# Altium schematic sheet Core.SchDoc
size A3
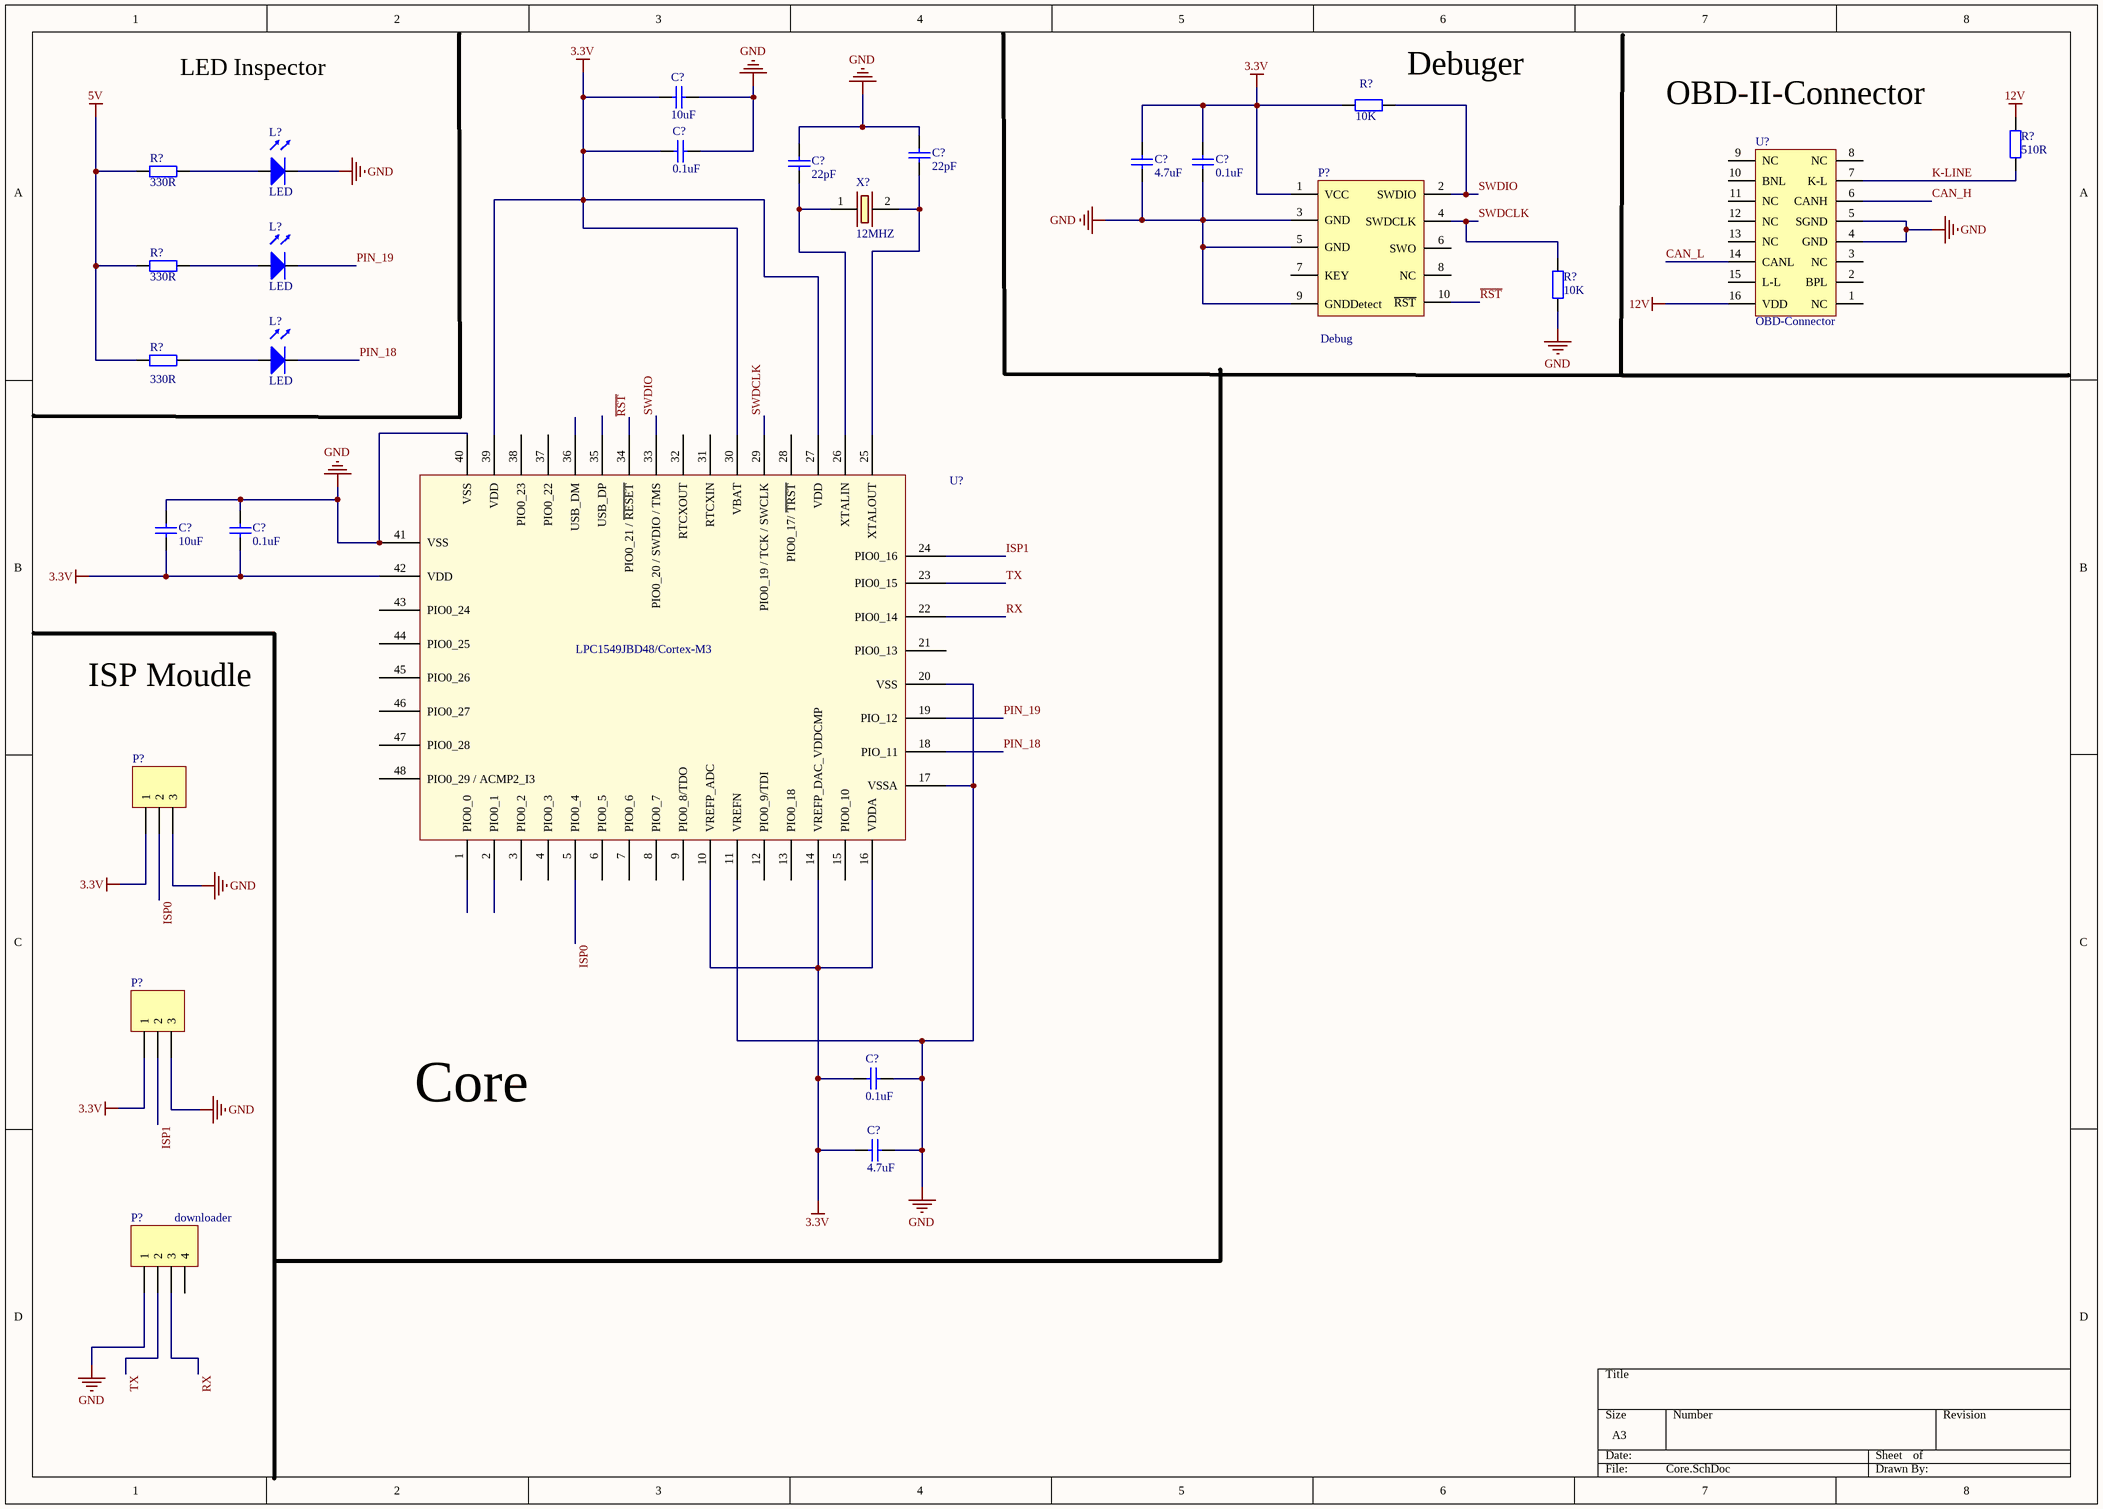
[diagram p0: Core.SchDoc]

## Parts
(Parts that share a designator on the sheet are numbered #1, #2 ... from top to bottom, then left to right.)
C?#1  10uF  [0603]
C?#2  0.1uF  [0603]
C?#3  22pF  [0603]
C?#4  22pF  [0603]
C?#5  4.7uF  [0603]
C?#6  0.1uF  [0603]
C?#7  10uF  [0603]
C?#8  0.1uF  [0603]
C?#9  0.1uF  [0603]
C?#10  4.7uF  [0603]
L?#1  LED  [0805]
L?#2  LED  [0805]
L?#3  LED  [0805]
P?#1  Debug  [JATG_10pin]
P?#2  (no value)  [HDR1X3]
P?#3  (no value)  [HDR1X3]
P?#4  downloader  [HDR1X4]
R?#1  10K  [0603]
R?#2  510R  [0603]
R?#3  330R  [0603]
R?#4  330R  [0603]
R?#5  10K  [0603]
R?#6  330R  [0603]
U?#1  OBD-Connector  [OBD-MaleConnector]
U?#2  LPC1549  [LPC1549JBD48]  (value not drawn)
X?  12MHZ  [12Mhz-DFN]

## Nets
3.3V: C?#1.2 C?#2.2 C?#5.2 C?#6.2 C?#7.1 C?#8.1 C?#9.2 C?#10.2 P?#1.1(VCC) P?#2.1 P?#3.1 R?#1.1 U?#2.10(VREFP_ADC) U?#2.14(VREFP_DAC_VDDCMP) U?#2.16(VDDA) U?#2.27(VDD) U?#2.30(VBAT) U?#2.39(VDD) U?#2.42(VDD)
5V: R?#3.1 R?#4.1 R?#6.1
12V: R?#2.2 U?#1.16(VDD)
GND: C?#1.1 C?#2.1 C?#3.2 C?#4.2 C?#5.1 C?#6.1 C?#7.2 C?#8.2 C?#9.1 C?#10.1 L?#1.2(K) P?#1.3(GND) P?#1.5(GND) P?#1.9(GNDDetect) P?#2.3 P?#3.3 P?#4.1 R?#5.1 U?#1.4(GND) U?#1.5(SGND) U?#2.11(VREFN) U?#2.17(VSSA) U?#2.20(VSS) U?#2.40(VSS) U?#2.41(VSS)
CAN_H: U?#1.6(CANH)
CAN_L: U?#1.14(CANL)
ISP0: P?#2.2 U?#2.5(PIO0_4)
ISP1: P?#3.2 U?#2.24(PIO0_16)
K-LINE: R?#2.1 U?#1.7(K-L)
PIN_18: L?#3.2(K) U?#2.18(PIO_11)
PIN_19: L?#2.2(K) U?#2.19(PIO_12)
~{RST}: P?#1.10(~{RST}) U?#2.34(PIO0_21_/_~{RESET})
RX: P?#4.3 U?#2.22(PIO0_14)
SWDCLK: P?#1.4(SWDCLK) R?#5.2 U?#2.29(PIO0_19_/_TCK_/_SWCLK)
SWDIO: P?#1.2(SWDIO) R?#1.2 U?#2.33(PIO0_20_/_SWDIO_/_TMS)
TX: P?#4.2 U?#2.23(PIO0_15)
NetC?#3_1: C?#3.1 U?#2.25(XTALOUT) X?.2
NetC?#4_1: C?#4.1 U?#2.26(XTALIN) X?.1
NetL?#1_1: L?#1.1(A) R?#3.2
NetL?#2_1: L?#2.1(A) R?#4.2
NetL?#3_1: L?#3.1(A) R?#6.2

Not connected (* = marked no-connect by the designer): P?#1 6(SWO) 7(KEY) 8(NC); P?#4 4; U?#1 1(NC) 2(BPL) 3(NC) 8(NC) 9(NC) 10(BNL) 11(NC) 12(NC) 13(NC) 15(L-L); U?#2 1(PIO0_0) 2(PIO0_1) 3(PIO0_2) 4(PIO0_3) 6(PIO0_5) 7(PIO0_6) 8(PIO0_7) 9(PIO0_8/TDO) 12(PIO0_9/TDI) 13(PIO0_18) 15(PIO0_10) 21(PIO0_13) 28(PIO0_17/_~{TRST}) 31(RTCXIN) 32(RTCXOUT) 35(USB_DP) 36(USB_DM) 37(PIO0_22) 38(PIO0_23) 43(PIO0_24) 44(PIO0_25) 45(PIO0_26) 46(PIO0_27) 47(PIO0_28) 48(PIO0_29_/_ACMP2_I3)

## Notes on the sheet
- LED Inspector
- (near R?#1) Debuger
- (near U?#1) OBD-II-Connector
- ISP Moudle
- Core
- (in symbol LPC1549JBD48) LPC1549JBD48/Cortex-M3

## Library data of the parts
C?#1-C?#10 = Cap1: ceramic
P?#1 = JTAG_10Pin
P?#2 P?#3 = Header 3: Header, 3-Pin; LatestRevisionDate: 17-Jul-2002; LatestRevisionNote: Re-released for DXP Platform.; Publisher: Altium Limited
P?#4 = Header 4: Header, 4-Pin; LatestRevisionDate: 17-Jul-2002; LatestRevisionNote: Re-released for DXP Platform.; Publisher: Altium Limited
R?#1-R?#6 = Res
U?#1 = OBD-MaleHead
U?#2 = LPC1549JBD48
X? = OSC